# EAGLE design WS2811_Extender_V1.1 (EAGLE 9.5.2)
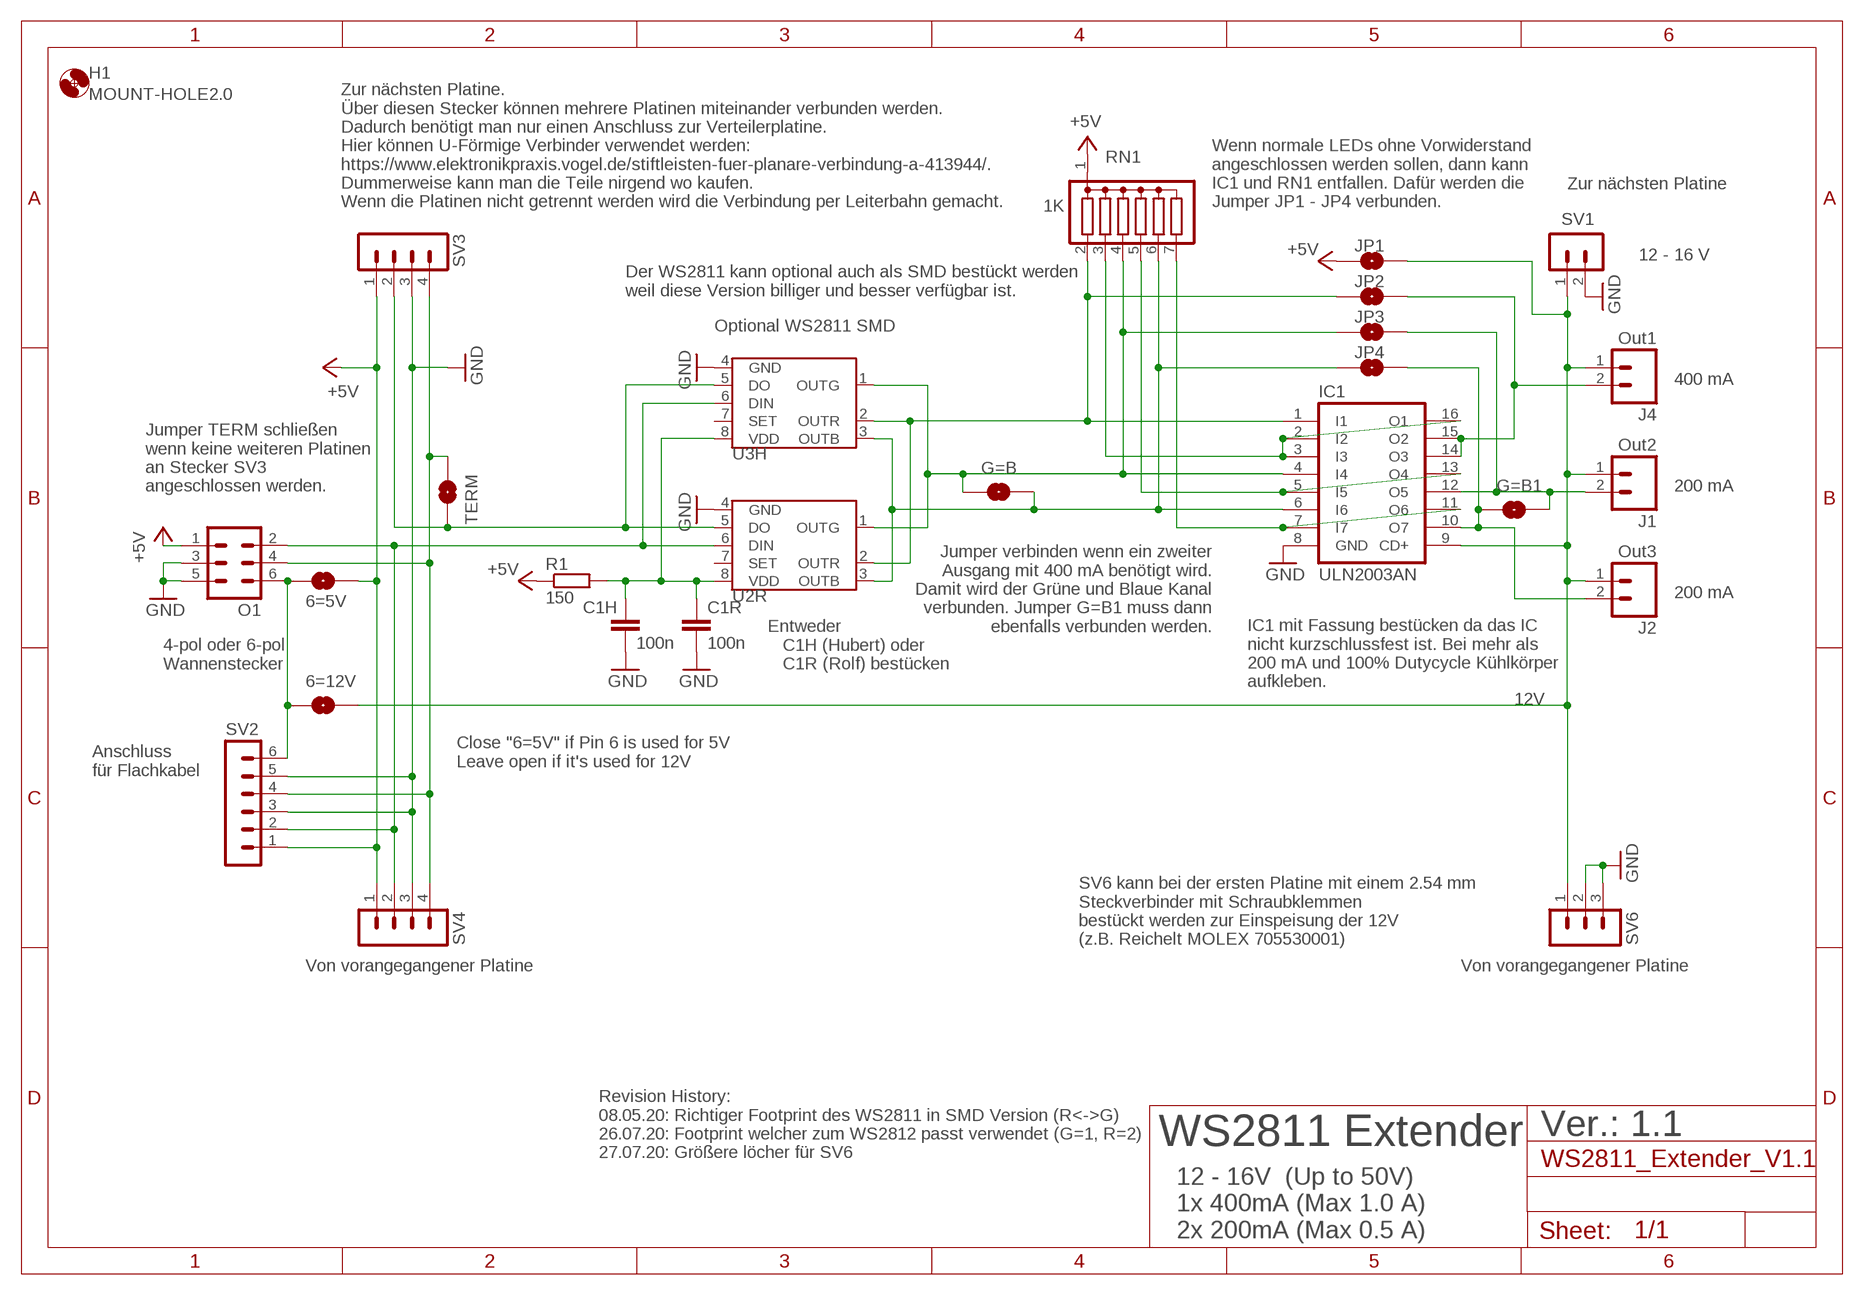
[diagram p0: schematic, sheet 1]

## Parts
6=5V  SOLDERJUMPERNO  [SJ_2S-NO]
6=12V  SOLDERJUMPERNO  [SJ_2S-NO]
C1H  100n  C-EUC1206  [C1206]
C1R  100n  C-EU025-024X044  [C025-024X044]
G=B  SOLDERJUMPERNO  [SJ_2S-NO]
G=B1  SOLDERJUMPERNO  [SJ_2S-NO]
H1  MOUNT-HOLE2.0  [2,0]
IC1  ULN2003AN  [DIL16]
J1  Out2  M02PTH  [1X02]
J2  Out3  M02PTH  [1X02]
J4  Out1  M02PTH  [1X02]
JP1  SOLDERJUMPERNO  [SJ_2S-NO]
JP2  SOLDERJUMPERNO  [SJ_2S-NO]
JP3  SOLDERJUMPERNO  [SJ_2S-NO]
JP4  SOLDERJUMPERNO  [SJ_2S-NO]
O1  ML6  [ML6]
R1  150  RCL_R-EU_0207/2V  [RCL_0207/2V]
RN1  1K  G06R  [SIL7]
SV1  MA02-1  [MA02-1]
SV2  MA06-1  [MA06-1]
SV3  MA04-1  [MA04-1]
SV4  MA04-1  [MA04-1]
SV6  MA03-1  [MA03-1]
TERM  SOLDERJUMPERNO  [SJ_2S-NO]
U2R  TINY45-20-DIP  S3PO_MODUL_WS2811_SOUND_MP3-TF-16P_WS2811_AND_ATTINY_WS2811-ICTINY45-20-DIP  [S3PO_MODUL_WS2811_SOUND_MP3-TF-16P_WS2811_AND_ATTINY_WS2811_DIP08]
U3H  WS2811 SOT-8  S3PO_MODUL_WS2811_SOUND_MP3-TF-16P_WS2811_AND_ATTINY_WS2811-ICSOP8  [SOP8]

## Nets
12V: 6=12V.2 IC1.9(CD+) J1.1 J2.1 J4.1 JP1.2 SV1.1 SV6.1
+5V: 6=5V.2 JP1.1 O1.1 R1.1 RN1.1 SV2.1 SV3.1 SV4.1
GND: C1H.2 C1R.2 IC1.8(GND) O1.3 O1.5 SV1.2 SV2.3 SV2.5 SV3.3 SV4.3 SV6.2 SV6.3 U2R.4(GND) U3H.4(GND)
N$1: O1.2 SV2.2 SV4.2 U2R.6(DIN) U3H.6(DIN)
N$2: SV3.2 TERM.2 U2R.5(DO) U3H.5(DO)
N$3: O1.4 SV2.4 SV3.4 SV4.4 TERM.1
N$4: C1H.1 C1R.1 R1.2 U2R.8(VDD) U3H.8(VDD)
N$5: IC1.1(I1) JP2.1 RN1.2 U2R.2(OUTR) U3H.2(OUTR)
N$6: 6=5V.1 6=12V.1 O1.6 SV2.6
N$8: G=B.2 IC1.6(I6) JP4.1 RN1.6 U2R.3(OUTB) U3H.3(OUTB)
N$9: IC1.2(I2) IC1.3(I3) IC1.16(O1) RN1.3
N$11: IC1.5(I5) IC1.13(O4) RN1.5
N$12: IC1.7(I7) IC1.11(O6) RN1.7
N$21: G=B.1 IC1.4(I4) JP3.1 RN1.4 U2R.1(OUTG) U3H.1(OUTG)
O1: IC1.14(O3) IC1.15(O2) J4.2 JP2.2
O2: G=B1.2 IC1.12(O5) J1.2 JP3.2
O3: G=B1.1 IC1.10(O7) J2.2 JP4.2
Unconnected: U2R.7(SET) U3H.7(SET)

## Notes on the sheet
- Zur nächsten Platine
- Zur nächsten Platine. 
  Über diesen Stecker können mehrere Platinen miteinander verbunden werden.
  Dadurch benötigt man nur einen Anschluss zur Verteilerplatine.
  Hier können U-Förmige Verbinder verwendet werden: 
  https://www.elektronikpraxis.vogel.de/stiftleisten-fuer-planare-verbindung-a-413944/.
  Dummerweise kann man die Teile nirgend wo kaufen.
  Wenn die Platinen nicht getrennt werden wird die Verbindung per Leiterbahn gemacht.
- Wenn normale LEDs ohne Vorwiderstand
  angeschlossen werden sollen, dann kann
  IC1 und RN1 entfallen. Dafür werden die
  Jumper JP1 - JP4 verbunden.
- 12 - 16 V
- Der WS2811 kann optional auch als SMD bestückt werden
  weil diese Version billiger und besser verfügbar ist.
- Optional WS2811 SMD
- 400 mA
- Jumper TERM schließen 
  wenn keine weiteren Platinen
  an Stecker SV3 
  angeschlossen werden.
- 200 mA
- Jumper verbinden wenn ein zweiter
  Ausgang mit 400 mA benötigt wird.
  Damit wird der Grüne und Blaue Kanal
  verbunden. Jumper G=B1 muss dann
  ebenfalls verbunden werden.
- 200 mA
- 4-pol oder 6-pol 
  Wannenstecker
- Entweder 
     C1H (Hubert) oder 
     C1R (Rolf) bestücken
- IC1 mit Fassung bestücken da das IC
  nicht kurzschlussfest ist. Bei mehr als 
  200 mA und 100% Dutycycle Kühlkörper
  aufkleben.
- Close "6=5V" if Pin 6 is used for 5V
  Leave open if it's used for 12V
- Anschluss
  für Flachkabel
- SV6 kann bei der ersten Platine mit einem 2.54 mm
  Steckverbinder mit Schraubklemmen
  bestückt werden zur Einspeisung der 12V
  (z.B. Reichelt MOLEX 705530001)
- Von vorangegangener Platine | Von vorangegangener Platine
- WS2811 Extender | Ver.: 1.1
- Revision History:
  08.05.20: Richtiger Footprint des WS2811 in SMD Version (R<->G)
  26.07.20: Footprint welcher zum WS2812 passt verwendet (G=1, R=2)
  27.07.20: Größere löcher für SV6
- 12 - 16V  (Up to 50V)
  1x 400mA (Max 1.0 A)
  2x 200mA (Max 0.5 A)

## Library data of the parts
6=5V 6=12V G=B G=B1 JP1-JP4 TERM = SparkFun-Retired:SOLDERJUMPER: Solder Jumper Standard SMD solder jumper. Used to automate production. Two varients : Normally Open and Normally Closed are the same, but have different paste layers. NC will have a large amount of paste and should jumper during reflow.
C1H C1R = rcl:C-EU: CAPACITOR, European symbol; SPICEPREFIX: C
H1 = holes:MOUNT-HOLE: MOUNTING HOLE with drill center marker
IC1 = uln-udn:ULN2003A: DRIVER ARRAY; REICHELT: ULN 2003A STM; REICHELT_EU: 0,22 €; REICHELT_LNK: https://www.reichelt.de/seven-darlington-arrays-dip-16-uln-2003a-stm-p216685.html?&trstct=pos_0
J1 J2 J4 = SparkFun-Connectors:M02: Standard 2-pin 0.1" header. Use with - straight break away headers ( PRT-00116) - right angle break away headers (PRT-00553) - swiss pins (PRT-00743) - machine pins (PRT-00117) - female headers (PRT-00115) Molex polarized connector foot print use with: PRT-08233 with associated crimp pins and housings. 2.54_SCREWTERM for use with PRT-10571. 3.5mm Screw Terminal footprints for PRT-08084 5mm Screw Terminal footprints for use with PRT-08432
O1 = con-harting-ml:ML6: HARTING; OC_FARNELL: unknown; OC_NEWARK: unknown
R1 = Sound_MP3-TF-16P_and_WS2811:RCL_R-EU_: RESISTOR, European symbol; SPICEPREFIX: R
RN1 = resistor-sil:G06R: SIL RESISTOR; OC_FARNELL: unknown; OC_NEWARK: unknown; REICHELT: SIL 7-6 1,0K; REICHELT_EU: 0,071 €; REICHELT_LNK: https://www.reichelt.de/widerstandsnetzwerk-1-0-kohm-sternschaltung-6wid-7pins-sil-7-6-1-0k-p17841.html?&trstct=pol_1
SV1 = con-lstb:MA02-1: PIN HEADER
SV2 = con-lstb:MA06-1: PIN HEADER; OC_FARNELL: unknown; OC_NEWARK: unknown
SV3 SV4 = con-lstb:MA04-1: PIN HEADER
SV6 = con-lstb:MA03-1: PIN HEADER
U2R = S3PO_Modul_WS2811:S3PO_MODUL_WS2811_SOUND_MP3-TF-16P_WS2811_AND_ATTINY_WS2811-IC: Die Pin Nummern für R und G sind getauscht damit sie gleich angesteuert werden wie die WS2812. Der Daten Strom der WS2811 ist RGB, Beim WS2812 ist es aber GRB.; PROD_ID: IC-09439
U3H = S3PO_Modul_WS2811:S3PO_MODUL_WS2811_SOUND_MP3-TF-16P_WS2811_AND_ATTINY_WS2811-IC: Die Pin Nummern für R und G sind getauscht damit sie gleich angesteuert werden wie die WS2812. Der Daten Strom der WS2811 ist RGB, Beim WS2812 ist es aber GRB.

## Board
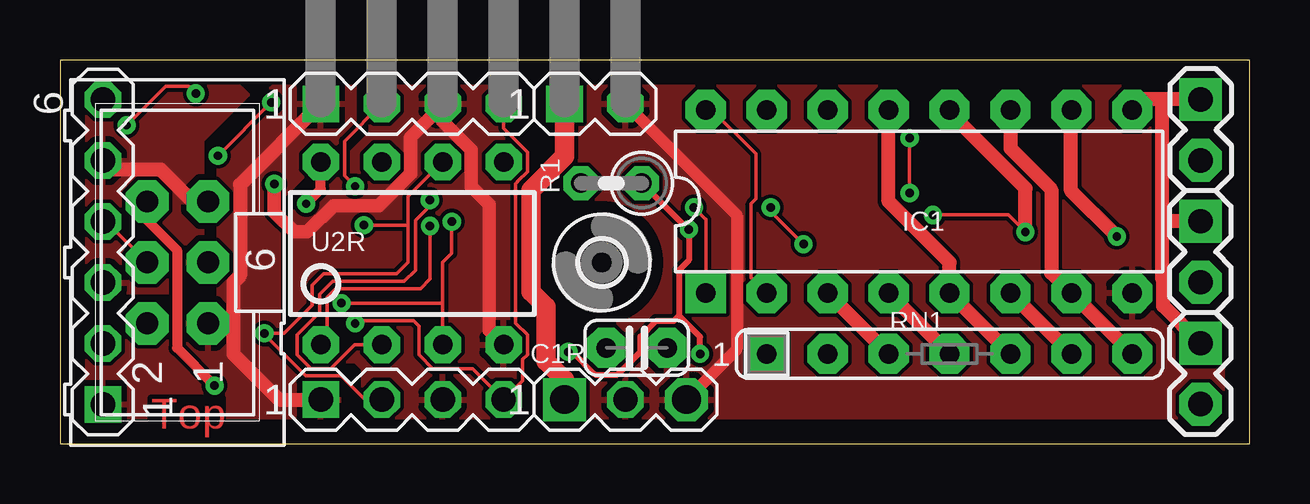
[diagram p1: board, top side]
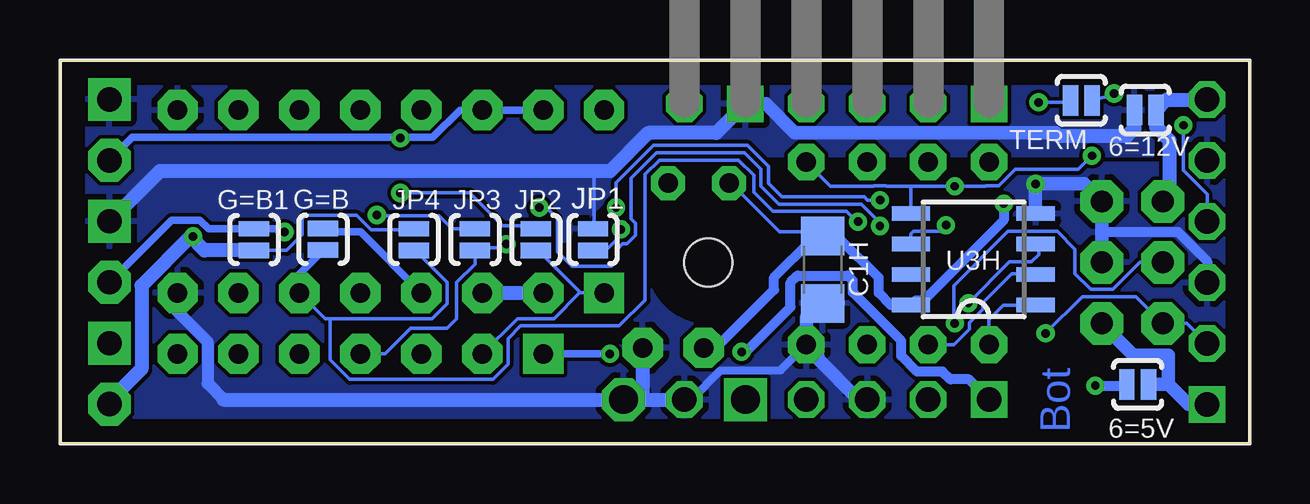
[diagram p2: board, bottom side, seen from below]

Size 49.6 x 15.99 mm. Coordinates in mm from the lower left corner, seen from the top.
Outline: 0,0 49.6,0 49.6,15.99 0,15.99 0,0
Copper layers (1*16): Top 0.035mm / dielectric 1.5mm / Bottom 0.035mm
Design rules "default": minimum track width 6mil, minimum drill 0.35mm, track to track 6mil, track to pad 6mil, pad to pad 6mil, via to via 6mil, smd to smd 6mil, copper to edge 40mil, drill to drill 6mil, minimum pad ring 10mil, minimum via ring 8mil, stop-mask expansion 4mil, vias tented up to drill 0mil, thermal gap 10mil

### Footprints (pad centres in the part's own frame; a part is rotated, then mirrored left to right if it is on the bottom)
SJ_2S-NO = smd 0.635 x 1.27: 1 -0.45,0; 2 0.45,0
C1206 = smd 1.6 x 1.8: 1 -1.4,0; 2 1.4,0
C025-024X044 = drill 0.813 pad 1.676 octagon: 1 -1.27,0; 2 1.27,0
2,0 = hole 2: 0,0
DIL16 = drill 0.813 pad 1.676 square: 1 -8.89,-3.81 | drill 0.813 pad 1.676 octagon: 2 -6.35,-3.81; 3 -3.81,-3.81; 4 -1.27,-3.81; 5 1.27,-3.81; 6 3.81,-3.81; 7 6.35,-3.81; 8 8.89,-3.81; 9 8.89,3.81; 10 6.35,3.81; 11 3.81,3.81; 12 1.27,3.81; 13 -1.27,3.81; 14 -3.81,3.81; 15 -6.35,3.81; 16 -8.89,3.81
1X02 = drill 1.016 pad 1.778 square: 1 0,0 | drill 1.016 pad 1.778 octagon: 2 2.54,0
ML6 = drill 0.914 pad 1.778 octagon: 1 -2.54,-1.27; 2 -2.54,1.27; 3 0,-1.27; 4 0,1.27; 5 2.54,-1.27; 6 2.54,1.27
RCL_0207/2V = drill 0.813 pad 1.422 octagon: 1 -1.27,0; 2 1.27,0
SIL7 = drill 0.813 pad 1.676 square: 1 -7.62,0 | drill 0.813 pad 1.676 octagon: 2 -5.08,0; 3 -2.54,0; 4 0,0; 5 2.54,0; 6 5.08,0; 7 7.62,0
MA02-1 = drill 1.016 pad 1.524 square: 1 -1.27,0 | drill 1.016 pad 1.524 octagon: 2 1.27,0
MA06-1 = drill 1.016 pad 1.524 square: 1 -6.35,0 | drill 1.016 pad 1.524 octagon: 2 -3.81,0; 3 -1.27,0; 4 1.27,0; 5 3.81,0; 6 6.35,0
MA04-1 = drill 1.016 pad 1.524 square: 1 -3.81,0 | drill 1.016 pad 1.524 octagon: 2 -1.27,0; 3 1.27,0; 4 3.81,0
MA03-1 = drill 1.2 square: 1 -3.81,0 | drill 1.016 pad 1.524 octagon: 2 -1.27,0 | drill 1.2 octagon: 3 1.27,0
S3PO_MODUL_WS2811_SOUND_MP3-TF-16P_WS2811_AND_ATTINY_WS2811_DIP08 = drill 0.813 pad 1.524 octagon: 1 -3.81,-3.81; 2 -1.27,-3.81; 3 1.27,-3.81; 4 3.81,-3.81; 5 3.81,3.81; 6 1.27,3.81; 7 -1.27,3.81; 8 -3.81,3.81
SOP8 = smd 0.6 x 1.6: 1 -1.905,-2.6; 2 -0.635,-2.6; 3 0.635,-2.6; 4 1.905,-2.6; 5 1.905,2.6; 6 0.635,2.6; 7 -0.635,2.6; 8 -1.905,2.6

### Placement (x,y rotation side)
6=5V  4.68,2.48 0 bottom
6=12V  4.36,13.91 180 bottom
C1H  17.81,7.25 270 bottom
C1R  24.04,4 0 top
G=B  38.63,8.52 270 bottom
G=B1  41.51,8.51 90 bottom
H1  22.59,7.55 0 top
IC1  35.81,10.1 0 top
J1  47.54,9.27 270 top
J2  47.54,4.19 270 top
J4  47.54,14.35 270 top
JP1  27.38,8.51 90 bottom
JP2  29.76,8.51 90 bottom
JP3  32.3,8.51 90 bottom
JP4  34.84,8.51 90 bottom
O1  4.9,7.55 90 top
R1  22.98,10.86 180 top
RN1  37.08,3.75 0 top
SV1  22.3,14.16 0 top
SV2  1.78,7.99 90 top
SV3  14.68,14.16 0 top
SV4  14.68,1.84 0 top
SV6  24.84,1.84 0 top
TERM  7.03,14.31 180 bottom
U2R  14.68,7.94 0 top
U3H  11.53,7.68 90 bottom

### Tracks (layer width: path | path; a pad name or v marks a point on that pad's centre or on a via)
12V
  Top 0.584: 45.95,14.35 45.14,14.35 IC1.9 | 45.95,9.46 45.95,6.84 45.98,6.82 45.98,5.74 J2.1 | 45.95,9.46 45.95,14.35 | 45.95,9.46 46.15,9.27 J1.1 | J4.1 45.95,14.35
  Top 0.813: SV1.1 21.03,11.97 19.63,10.57 19.63,6.33 20.25,5.71 20.25,3.44 21.03,2.67 SV6.1
  Bottom 0.152: 27.34,11.37 27.34,9.01 JP1.2
  Bottom 0.559: 20.18,14.16 18.99,12.97 8.12,12.97 8.11,12.95
  Bottom 0.584: 6=12V.2 4.81,13.14 5.12,12.83 7.98,12.83 8.11,12.95 | 20.18,14.16 SV1.1 22.24,12.95 25.08,12.95 26.67,11.37 27.34,11.37 45.44,11.37 J1.1
  pour Bottom: 48.5,15.18 4.36,15.18 4.04,14.86 4.04,12 25,12 28.81,8.19 48.5,8.19
+5V  (via drill 0.35)
  Top 0.254: v26.68,3.75 26.68,4.45 25.8,5.33 | 25.8,5.33 25.8,7.24 26.22,7.65 v26.22,8.93 26.18,8.93 R1.1 | 25.8,5.33 25.59,5.12 24.85,5.12 24.19,4.46 24.19,3.84 23.23,2.88 22.31,2.88 21.36,3.83 v21.19,3.83
  Top 0.584: 7.22,5.01 7.22,6.72 7.51,7 7.51,10.79 SV3.1 | 7.22,5.01 7.22,3.75 9.12,1.84 SV4.1 | O1.1 7.22,5.01
  Bottom 0.152: v26.22,8.93 26.36,8.79 26.36,8.54 26.85,8.06 JP1.1
  Bottom 0.305: RN1.1 v26.68,3.75
  Bottom 0.406: v21.19,3.83 21,3.83 19.14,5.69 19.14,6.72 18.86,7.01 16.77,7.01 16.56,6.8 16.56,6.31 14.53,4.28 14.53,3.66 13.87,3.01 12.81,3.01 12.48,2.68 11.71,2.68 SV4.1
  Bottom 0.559: O1.1 4.85,3.69 3.41,3.69 3.41,2.48 | 6=5V.2 3.41,2.48 | 3.41,2.48 2.57,1.64 SV2.1
  pour Top: 12.3,15.18 12.3,13.27 9.12,10.1 9.12,3.75 10.08,2.79 11.66,2.79 11.66,0.25 0.23,0.25 0.23,4.7 1.19,5.65 6.27,5.65 6.58,5.97 6.58,12 8.49,13.91 8.49,14.54 9.12,15.18
GND  (via drill 0.35)
  Top 0.152: 15.88,14.05 SV3.3
  Top 0.508: SV1.2 28.21,9.52 28.21,3.94 SV6.3
  Top 0.559: 15.88,14.05 14.61,12.77 14.61,11.25 13.27,9.92 11.41,9.92 10.31,8.83 9.76,8.83 8.94,9.65 v8.94,10.83 | U2R.4 17.89,4.73 17.89,9.99 17.15,10.73 17.15,12.24 15.95,13.43 SV3.3
  Top 0.584: SV2.5 2.15,11.43 4.18,11.43 5.52,10.1 O1.5
  Bottom 0.33: U2R.4 19.56,3.06 22.06,3.06 23.28,1.84 SV6.2
  Bottom 0.406: 6.17,8.83 3,8.83 1.78,7.6 SV2.3
  Bottom 0.508: IC1.8 44.7,5.5 43.45,4.26 43.45,2.51 42.78,1.84
  Bottom 0.559: O1.3 6.17,8.83 O1.5 6.9,10.83 v8.94,10.83 U3H.4 | C1H.2 18.49,5.27 U2R.4 18.01,3.64 18.01,3.54 16.31,1.84 SV4.3
  Bottom 0.584: 42.78,1.84 SV6.3 25.32,1.84 | 25.32,1.84 SV6.2 | C1R.2 25.31,1.85 25.32,1.84
  pour Bottom: 48.5,0.57 0.55,0.57 0.55,15.18 3.09,15.18 3.09,12.32 3.73,11.68 24.68,11.68 28.49,7.87 48.5,7.87
  pour Top: 0.87,6.28 5.95,6.28 5.95,11.37 5.95,12.63 7.86,14.54 7.22,15.18 0.23,15.18 0.23,6.92
  pour Top: 12.62,0.57 48.5,0.57 49.13,1.21 49.13,15.18 13.25,15.18 12.94,14.86 12.94,12.95 9.76,9.78 9.76,9.14 9.76,4.38 10.08,4.06 10.71,3.43 12.3,3.43 12.62,3.11 12.62,2.79
N$1  (via drill 0.35)
  Top 0.152: SV4.2 12.72,1.84 11.73,2.83 10.24,2.83 8.52,4.56 v8.52,4.6 9.35,4.6 10.52,5.77 10.52,6.6 10.99,7.08 14.03,7.08 14.51,7.55 14.51,9.14 | 14.51,9.14 14.51,10.31 U2R.6 | v12.67,9.11 14.48,9.11 14.51,9.14
  Bottom 0.152: v8.52,4.6 6.99,6.13 4.76,6.13 3.65,5.01 O1.2 2.62,5.01 SV2.2 | v12.67,9.11 12.93,8.85 14.03,8.85 14.13,8.75 U3H.6
N$2  (via drill 0.35)
  Top 0.152: v8.81,14.22 v6.58,12 | v12.3,10.73 11.86,11.17 11.86,12.61 SV3.2
  Bottom 0.152: v8.81,14.22 7.8,14.22 TERM.2 | 14.21,10.73 v12.3,10.73 11.03,10.73 11,10.76 10.46,10.76 9.78,11.43 7.15,11.43 v6.58,12 | 14.21,10.73 15.14,10.73 15.17,10.76 15.67,10.76 15.7,10.73 17.48,10.73 U2R.5 | U3H.5 14.13,10.66 14.21,10.73
N$3  (via drill 0.35)
  Top 0.152: SV3.4 18.49,13.15 19.48,12.16 19.48,11.34 19.08,10.93 19.08,10.92 19,10.84 19,5.02 19.48,4.54 19.48,3.72 19.29,3.52 19.29,2.63 SV4.4 17.2,3.14 15.54,3.14 14.96,3.72 14.96,4.89 14.74,5.12 12.4,5.12 v12.3,5.01 | O1.4 1.93,9.26 SV2.4 | v2.77,13.27 4.4,14.9 5.36,14.9 v5.66,14.6
  Bottom 0.152: TERM.1 5.66,14.54 v5.66,14.6 | O1.4 4.59,7.55 5.71,6.44 6.63,6.44 7.29,7.09 7.29,8.1 8.04,8.85 10.09,8.85 12.34,6.59 12.34,5.06 v12.3,5.01 | SV2.4 1.78,10.4 2.77,11.39 v2.77,13.27
N$4  (via drill 0.35)
  Top 0.406: v10.26,10 10.87,10.61 U2R.8
  Bottom 0.152: C1H.1 17.99,8.83 19.6,8.83 21.64,10.86 R1.2
  Bottom 0.203: 17.81,8.51 C1H.1
  Bottom 0.406: v10.26,10 10.26,9.31 13.57,6 13.57,5.97 13.94,5.97 U3H.8 14.97,5.78 15.47,6.28 15.47,6.92 17.06,8.51 17.81,8.51 18.26,8.51 19.83,6.94 19.83,6.42 22.25,4 C1R.1
N$5  (via drill 0.35)
  Top 0.152: IC1.1 26.92,9.35 26.88,9.38 v26.42,9.84 | v15.42,10.15 15.42,9.93 14.82,9.32 14.82,7.23 14.35,6.77 11.36,6.77 10.82,6.24 10.82,5.48 9.88,4.54 9.88,3.72 10.46,3.14 11.28,3.14 12.27,4.13 U2R.2
  Bottom 0.152: v15.42,10.15 15.94,10.15 16.08,10.29 19.51,10.29 20.07,10.86 20.07,11.57 20.94,12.43 24.87,12.43 26.42,10.88 v26.42,9.84 | RN1.2 30.52,5.22 29.02,5.22 27.95,6.28 | 27.95,6.28 IC1.1 | JP2.1 29.62,8.01 27.95,6.34 27.95,6.28 | U2R.2 12.33,4.13 11.69,4.76 11.69,5.04 11.13,5.61 11.13,5.87 9.92,7.08 8.96,7.08 U3H.2
N$6  (via drill 0.35)
  Top 0.406: O1.6 3.63,9.32 4.88,8.07 4.88,3.99 v6.44,2.42
  Bottom 0.406: v6.44,2.42 5.18,2.42 6=5V.1
  Bottom 0.584: O1.6 3.35,10.38 3.35,12.63 3.91,13.2 6=12V.1 3.48,14.34 SV2.6
N$8  (via drill 0.35)
  Top 0.152: v11.73,5.86 15.91,5.86 15.95,5.9 | 15.95,5.9 15.95,7.55 16.33,7.94 v16.33,9.26 | 15.95,5.9 U2R.3
  Top 0.584: IC1.6 RN1.6
  Bottom 0.152: v16.33,9.26 16.4,9.26 16.82,9.68 19.89,9.68 20.68,10.48 20.68,11.19 21.32,11.82 24.61,11.82 25.21,11.22 25.21,5.99 26.29,4.91 30.4,4.91 30.93,4.38 30.93,3.3 31.56,2.68 37.52,2.68 38.34,3.49 38.34,5.22 | U3H.3 8.81,8.19 8.81,7.87 9.1,7.58 10.02,7.58 v11.73,5.86 | JP4.1 34.8,8.06 33.47,6.73 33.47,5.84 34.1,5.22 38.34,5.22 | IC1.6 38.55,5.22 38.34,5.22
  Bottom 0.305: G=B.2 39.62,7.09 IC1.6
N$9
  Top 0.152: IC1.2 28.82,6.92 28.81,6.92 28.81,10 29.01,10.2 29.01,12.07 27.18,13.91 IC1.16
  Top 0.584: IC1.3 RN1.3
  Bottom 0.584: IC1.3 IC1.2
N$11
  Top 0.584: RN1.5 IC1.5 37.08,7.55 34.54,10.1 IC1.13
N$12
  Top 0.584: RN1.7 IC1.7 41.32,7.12 41.32,10.6 39.62,12.3 IC1.11
N$21  (via drill 0.35)
  Top 0.152: v15.42,9.07 15.42,6.87 15.02,6.47 11.48,6.47 11.13,6.11 11.13,4.38 U2R.1 | v30.99,8.32 29.62,9.69 v29.62,9.84
  Top 0.584: IC1.4 RN1.4
  Bottom 0.152: v15.42,9.07 15.42,9.21 16.2,9.98 19.63,9.98 20.38,10.73 20.38,11.44 21.06,12.13 24.74,12.13 25.81,11.06 25.81,9.38 25.61,9.18 25.61,8.68 25.96,8.33 26.15,8.33 26.36,8.11 26.36,7.64 26.6,7.4 28.26,7.4 28.86,8 28.86,9.38 29.32,9.84 v29.62,9.84 | RN1.4 36.05,3.75 34.98,4.81 33.46,4.81 33.07,5.21 33.07,6.73 32.3,7.49 JP3.1 32.21,8.17 31.15,8.17 v30.99,8.32 | U3H.1 10.27,5.78 10.87,5.17 U2R.1
  Bottom 0.305: G=B.1 38.49,8.83 37.08,8.83 IC1.4
O1  (via drill 0.35)
  Top 0.152: v35.41,12.74 v35.41,10.45
  Bottom 0.152: v35.41,10.45 32.52,10.45 31.15,9.08 29.78,9.08 JP2.2 | v35.41,12.74 35.41,12.76
  Bottom 0.305: J4.2 46.59,12.76 35.41,12.76 34.06,12.76 32.92,13.91 IC1.14 IC1.15
O2  (via drill 0.35)
  Top 0.152: v36.39,9.53 39.53,9.53 v40.24,8.83
  Top 0.584: v40.24,8.83 40.24,10.64 37.08,13.8 IC1.12
  Bottom 0.152: JP3.2 33.25,8.96 33.8,9.5 36.36,9.5 v36.39,9.53
  Bottom 0.305: v40.24,8.83 40.37,8.96 G=B1.2 43.4,8.96 43.77,9.32 44.95,9.32 J1.2
O3  (via drill 0.35)
  Top 0.584: IC1.10 42.15,13.89 42.15,10.54 v44.05,8.64
  Bottom 0.152: JP4.2 34.98,8.93 36.64,8.93 37.23,9.52 39.36,9.52 39.5,9.38 39.5,8.71 40.15,8.06 G=B1.1
  Bottom 0.584: J2.2 47.54,1.78 46.2,3.12 46.2,6.59 44.16,8.64 | v44.05,8.64 44.16,8.64 | G=B1.1 43.58,8.06 44.16,8.64

### Text on the board
Top: Top
Bottom: Bot
tDocu: + | Out 1 | + | Out 2 | + | Out 3 | WS2811 Extender V 1.1
bDocu: 5/12V | => | <= | +5V | GND | +12V | GND | + | Out 1 | GND | max 50V | 400 mA | WS2811 Extender | Out | + | Out 2 | GND | 200 mA | In | + | Out 3 | 1 | 200 mA | +5V | <= | +5V | => | GND | +12V | GND | Stummis & Hardi | 27.07.20